# Altium project LeBot.PrjPCB
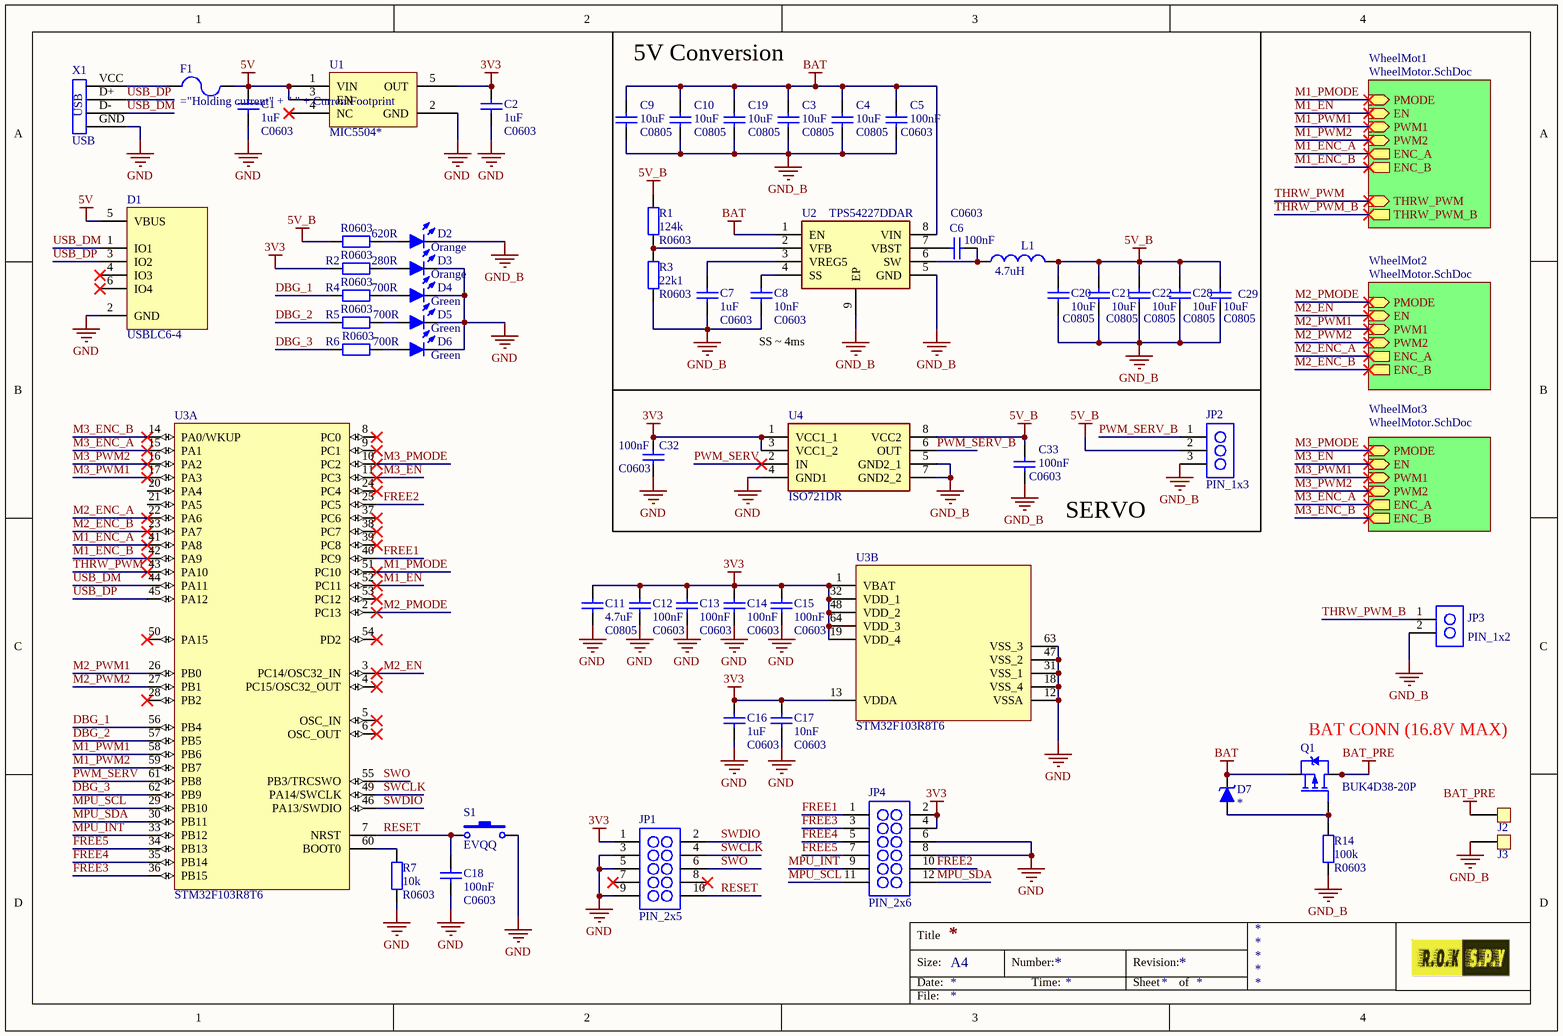
[diagram p0: LeBot.SchDoc]
2 sheets, 126 parts. Net scope: hierarchical (ports join the sheet entries above them; power ports are global).
Board file: LeBot.PcbDoc
Sheets:
  LeBot.SchDoc
    WheelMot1 = WheelMotor.SchDoc
    WheelMot2 = WheelMotor.SchDoc
    WheelMot3 = WheelMotor.SchDoc

## Sheet LeBot.SchDoc
size A4

### Parts
C1  Capacitance: 1uF  [C0603]
C2  Capacitance: 1uF  [C0603]
C3  Capacitance: 10uF  [C0805]
C4  Capacitance: 10uF  [C0805]
C5  Capacitance: 100nF  [C0603]
C6  Capacitance: 100nF  [C0603]
C7  Capacitance: 1uF  [C0603]
C8  Capacitance: 10nF  [C0603]
C9  Capacitance: 10uF  [C0805]
C10  Capacitance: 10uF  [C0805]
C11  Capacitance: 4.7uF  [C0805]
C12  Capacitance: 100nF  [C0603]
C13  Capacitance: 100nF  [C0603]
C14  Capacitance: 100nF  [C0603]
C15  Capacitance: 100nF  [C0603]
C16  Capacitance: 1uF  [C0603]
C17  Capacitance: 10nF  [C0603]
C18  Capacitance: 100nF  [C0603]
C19  Capacitance: 10uF  [C0805]
C20  Capacitance: 10uF  [C0805]
C21  Capacitance: 10uF  [C0805]
C22  Capacitance: 10uF  [C0805]
C28  Capacitance: 10uF  [C0805]
C29  Capacitance: 10uF  [C0805]
C32  Capacitance: 100nF  [C0603]
C33  Capacitance: 100nF  [C0603]
D1  USBLC6-4  [SOT-236]
D2  Colour: Orange  [LED_0805]
D3  Colour: Orange  [LED_0805]
D4  Colour: Green  [LED_0805]
D5  Colour: Green  [LED_0805]
D6  Colour: Green  [LED_0805]
D7  *  [SOT23-Zener]
F1  (no value)  [F1210]
J2  Connection_pad  [Wire_Pad]  (value not drawn)
J3  Connection_pad  [Wire_Pad]  (value not drawn)
JP1  PIN_2x5  [1.27_2X5H]
JP2  PIN_1x3  [1.27_1X3H]
JP3  PIN_1x2  [1.27_1X2H]
JP4  PIN_2x6  [1.27_2X6H]
L1  Inductance: 4.7uH  [L73]  (hidden comment: Inductor)
Q1  BUK4D38-20P  [PMPB12EPX]
R1  124k  [R0603]
R2  280R  [R0603]
R3  22k1  [R0603]
R4  700R  [R0603]
R5  700R  [R0603]
R6  700R  [R0603]
R7  10k  [R0603]
R8  620R  [R0603]
R14  100k  [R0603]
S1  EVQQ  [EVQQ]
U1  MIC5504*  [SOT-235]
U2  TPS54227DDAR  [SOIC127P600X175-8N]
U3  STM32F103R8T6  [QFP50P1200X1200X160-64N]  (parts A,B of 2)
U4  ISO721DR  [SOIC127P600X175-8N]
X1  USB  [USB MicroB Type 2.0]

### Sub-sheets
WheelMot1 = WheelMotor.SchDoc: PMODE (in), EN (in), PWM2 (in), ENC_A (out), PWM1 (in), ENC_B (out), THRW_PWM (in), THRW_PWM_B (out)
WheelMot2 = WheelMotor.SchDoc: PMODE (in), EN (in), PWM2 (in), ENC_A (out), PWM1 (in), ENC_B (out)
WheelMot3 = WheelMotor.SchDoc: PMODE (in), EN (in), PWM2 (in), ENC_A (out), PWM1 (in), ENC_B (out)

### Nets
3V3: C2.2 C11.2 C12.2 C13.2 C14.2 C15.2 C16.2 C17.2 C32.2 JP1.1 JP4.2 JP4.4 R2.2 U1.5(OUT) U3.1(VBAT) U3.13(VDDA) U3.19(VDD_4) U3.32(VDD_1) U3.48(VDD_2) U3.64(VDD_3) U4.1(VCC1_1) U4.3(VCC1_2)
5V: C1.2 D1.5(VBUS) F1.2 U1.1(VIN) U1.3(EN)
5V_B: C20.2 C21.2 C22.2 C28.2 C29.2 C33.2 JP2.2 L1.2 R1.2 R8.2 U4.8(VCC2)
BAT: C3.2 C4.2 C5.2 C9.2 C10.2 C19.2 D7.2(K) Q1.1(S) U2.1(EN) U2.8(VIN)
BAT_PRE: J2.1 Q1.3(D) Q1.D0(D) Q1.D1(D) Q1.D2(D)
GND: C1.1 C2.1 C11.1 C12.1 C13.1 C14.1 C15.1 C16.1 C17.1 C18.1 C32.1 D1.2(GND) D3.2(K) D4.2(K) D5.2(K) D6.2(K) JP1.3 JP1.5 JP1.9 JP4.6 JP4.8 R7.1 S1.2 U1.2(GND) U3.12(VSSA) U3.18(VSS_4) U3.31(VSS_1) U3.47(VSS_2) U3.63(VSS_3) U4.4(GND1) X1.GND
GND_B: C3.1 C4.1 C5.1 C7.1 C8.1 C9.1 C10.1 C19.1 C20.1 C21.1 C22.1 C28.1 C29.1 C33.1 D2.2(K) J3.1 JP2.3 JP3.2 R3.1 R14.2 U2.5(GND) U2.9(EP) U4.5(GND2_1) U4.7(GND2_2)
DBG_1: R4.2 U3.56(PB4)
DBG_2: R5.2 U3.57(PB5)
DBG_3: R6.2 U3.62(PB9)
FREE1: JP4.1 U3.40(PC9)
FREE2: JP4.10 U3.25(PC5)
FREE3: JP4.3 U3.36(PB15)
FREE4: JP4.5 U3.35(PB14)
FREE5: JP4.7 U3.34(PB13)
M1_EN: U3.52(PC11) ; sheet WheelMot1/EN
M1_ENC_A: U3.41(PA8) ; sheet WheelMot1/ENC_A
M1_ENC_B: U3.42(PA9) ; sheet WheelMot1/ENC_B
M1_PMODE: U3.51(PC10) ; sheet WheelMot1/PMODE
M1_PWM1: U3.58(PB6) ; sheet WheelMot1/PWM1
M1_PWM2: U3.59(PB7) ; sheet WheelMot1/PWM2
M2_EN: U3.3(PC14/OSC32_IN) ; sheet WheelMot2/EN
M2_ENC_A: U3.22(PA6) ; sheet WheelMot2/ENC_A
M2_ENC_B: U3.23(PA7) ; sheet WheelMot2/ENC_B
M2_PMODE: U3.2(PC13) ; sheet WheelMot2/PMODE
M2_PWM1: U3.26(PB0) ; sheet WheelMot2/PWM1
M2_PWM2: U3.27(PB1) ; sheet WheelMot2/PWM2
M3_EN: U3.11(PC3) ; sheet WheelMot3/EN
M3_ENC_A: U3.15(PA1) ; sheet WheelMot3/ENC_A
M3_ENC_B: U3.14(PA0/WKUP) ; sheet WheelMot3/ENC_B
M3_PMODE: U3.10(PC2) ; sheet WheelMot3/PMODE
M3_PWM1: U3.17(PA3) ; sheet WheelMot3/PWM1
M3_PWM2: U3.16(PA2) ; sheet WheelMot3/PWM2
MPU_INT: JP4.9 U3.33(PB12)
MPU_SCL: JP4.11 U3.29(PB10)
MPU_SDA: JP4.12 U3.30(PB11)
PWM_SERV: U3.61(PB8) U4.2(IN)
PWM_SERV_B: JP2.1 U4.6(OUT)
RESET: C18.2 JP1.10 S1.1 U3.7(NRST)
SWCLK: JP1.4 U3.49(PA14/SWCLK)
SWDIO: JP1.2 U3.46(PA13/SWDIO)
SWO: JP1.6 U3.55(PB3/TRCSWO)
THRW_PWM: U3.43(PA10) ; sheet WheelMot1/THRW_PWM
THRW_PWM_B: JP3.1 ; sheet WheelMot1/THRW_PWM_B
USB_DM: D1.1(IO1) U3.44(PA11) X1.D-
USB_DP: D1.3(IO2) U3.45(PA12) X1.D+
NetC6_1: C6.1 L1.1 U2.6(SW)
NetC6_2: C6.2 U2.7(VBST)
NetC7_2: C7.2 U2.3(VREG5)
NetC8_2: C8.2 U2.4(SS)
NetD2_1: D2.1(A) R8.1
NetD3_1: D3.1(A) R2.1
NetD4_1: D4.1(A) R4.1
NetD5_1: D5.1(A) R5.1
NetD6_1: D6.1(A) R6.1
NetD7_1: D7.1(A) Q1.2(G) R14.1
NetF1_1: F1.1 X1.VCC
NetR1_1: R1.1 R3.2 U2.2(VFB)
NetR7_2: R7.2 U3.60(BOOT0)

Not connected (* = marked no-connect by the designer): D1 4(IO3)* 6(IO4)*; JP1 7* 8*; U1 4(NC)*; U3 4(PC15/OSC32_OUT)* 5(OSC_IN)* 6(OSC_OUT)* 8(PC0)* 9(PC1)* 20(PA4) 21(PA5) 24(PC4)* 28(PB2)* 37(PC6)* 38(PC7)* 39(PC8)* 50(PA15)* 53(PC12)* 54(PD2)*

### Notes on the sheet
- 5V Conversion
- SS ~ 4ms
- SERVO
- (near Q1) BAT CONN (16.8V MAX)
- Title
- Size:
- Date:
- A4
- Number:
- Time:
- Revision:
- Sheet
- of
- File:

### Library data of the parts
C1-C22 C28 C29 C32 C33 = Capacitor: Ceramic capacitor; Type: MLCC; Voltage rating: *V; ComponentLinknDescription: Datasheet; Characteristic: *; Manufacturer: *; ComponentLinknURL: *
  C1 C2 C5-C8 C12-C18 C32 C33: Note: C0603
  C3 C4 C9-C11 C19-C22 C28 C29: Note: C0805
D1 = USBLC6-4: USB ESD Protection; Manufacturer: ST Microelectronics; ComponentLinknDescription: Datasheet; Space heritage: false; Verified: false; Part number: USBLC6-4
D2 D3 = LED: Light Emitting Diode; Part number: MC011368; ComponentLinknDescription: Datasheet; Forward Voltage: 2.1V; Space heritage: false; Forward Current: 20mA; Power dissipation: false; Farnell Order Nr: 3015159
D4-D6 = LED: Light Emitting Diode; Part number: KP-2012LSGC; ComponentLinknDescription: Datasheet; Forward Voltage: 1.9V; Space heritage: false; Forward Current: 2mA; Power dissipation: false; Farnell Order Nr: 2463991
D7 = Zener Diode: PartNumber: *; Parameter 3: *; Parameter 4: *; Farnell Order Nr: *; Zener Voltage: *; Parameter 2: *
F1 = Fuse: Operating voltage: *V; Initial resistance: *R; Carrying current: *A; ComponentLinknDescription: Datasheet; Type: *; Manufacturer: *; Tripping current: *A; Holding current: *A; ComponentLinknURL: *; Comment_1: *; Note: ="Holding current" + " " + CurrentFootprint
L1 = Inductor: Saturation current: *A; DC resistance: *R; Self resonant frequency: *Hz; ComponentLinknDescription: Datasheet; Core material: *; RMS current: *A; Construction: *; ComponentLinknURL: *; Manufacturer: *; Note: =Inductance + " " + CurrentFootprint
Q1 = P-Channel MOSFET: GS breakdown Volt: 12V/-12V; DS Breakdown Volt: -20V; Drain Current: -18A; rDSon: 30mOhm; PartNumber: BUK4D38-20P; Farnell Order Nr: 3526152; Mouser Order Nr: 771-BUK4D38-20PX; Datasheet: https://eu.mouser.com/datasheet/2/916/BUK4D38-20P-1880069.pdf; Parameter 1: *
R1-R8 R14 = Resistor: Precision: *%; Voltage rating: *V; Temp coefficient: *ppm; Power rating: *mW; ComponentLinknDescription: Datasheet; Manufacturer: *; ComponentLinknURL: *; Note: R0603
  R1: Resistance: 124k
  R2: Resistance: 280R
  R3: Resistance: 22k1
  R4-R6: Resistance: 700R
  R7: Resistance: 10k
  R8: Resistance: 620R
  R14: Resistance: 100k
S1 = EVQQ: Switch; Manufacturer: Panasonic; ComponentLinknDescription: Datasheet; Space heritage: false; Drawn by: Erik Ilbis; Verified: false; Part number: EVQQ
U1 = MIC5504: Low-dropout voltage regulator; Manufacturer: Microchip/Micrel; Space heritage: false; Current Rating: 300 mA; Input Voltage: 2V5 to 5V5; Accuracy: 2%; Part number: MIC5504; Verified: false; Drawn by: Roberts Oskars Komarovskis; ComponentLink1Description: Datasheet; ComponentLink1URL: https://www.mouser.ee/datasheet/2/268/MIC550X-1082389.pdf; Package Type: *
U2 = TPS54227DDAR: 4.5-V to 18-V Input, 2-A SynchronousStep-DownConverter; Manufacturer_Name: Texas Instruments; Datasheet Link: http://www.ti.com/lit/gpn/tps54227; Height: 1.7mm; Manufacturer_Part_Number: TPS54227DDAR; PartNumber: TPS54227DDAR; Farnell Order Nr: 3007320
U3 = STM32F103R8T6: Medium-density performance line ARM®-based 32-bit MCU with 64 or 128 KB Flash, USB, CAN, 7 timers, 2 ADCs, 9 com. interfaces; PartNumber: STM32F103R8T6; Drawn By: Roberts Oskars Komarovskis; Farnell Order Nr: 3129750; ComponentLink1Description: Datasheet; ComponentLink1URL: https://4donline.ihs.com/images/VipMasterIC/IC/SGST/SGST-S-A0001117293/SGST-S-A0001117293-1.pdf?hkey=6D3A4C79FDBF58556ACFDE234799DDF0
U4 = ISO721DR: SO72xSingleChannelHigh-SpeedDigitalIsolators; Manufacturer_Name: Texas Instruments; Datasheet Link: http://www.ti.com/lit/gpn/ISO721; Height: 1.75mm; Manufacturer_Part_Number: ISO721DR; Farnell Order Nr: 3124779; PartNumber: ISO721DR
JP1 = PIN_2x5: Manufacturer: *; Part Number: *; ComponentLinknDescription: *; ComponentLinknURL: *; Drawn By: Erik Ilbis
JP2 = PIN_1x3: Manufacturer: *; Part Number: *; ComponentLinknDescription: *; ComponentLinknURL: *; Drawn By: Erik Ilbis
JP3 = PIN_1x2: Manufacturer: *; Part Number: *; ComponentLinknURL: *; Drawn By: Erik Ilbis; ComponentLinknDescription: *
JP4 = PIN_2x6: Manufacturer: *; Part Number: *; ComponentLinknDescription: *; ComponentLinknURL: *; Drawn By: Erik Ilbis

## Sheet WheelMotor.SchDoc
size A4
Used 3 times, as channels WheelMot1, WheelMot2, WheelMot3. Parts and nets are listed once, with the designators drawn on the sheet.
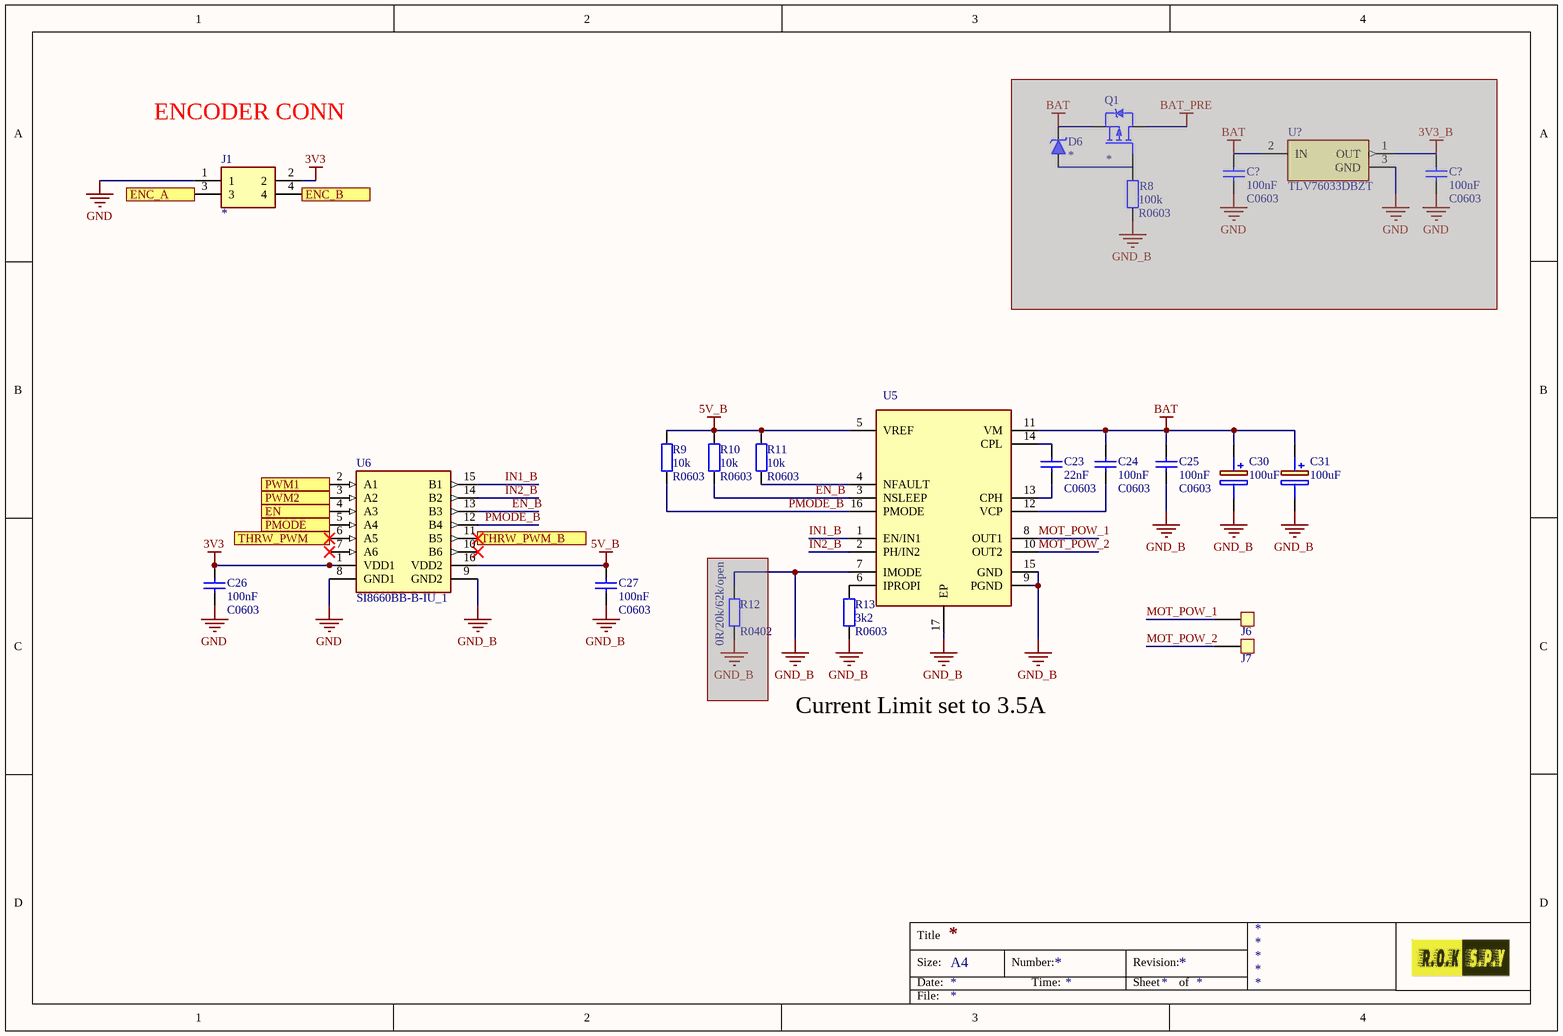
[diagram p1: WheelMotor.SchDoc]

### Parts
(Parts that share a designator on the sheet are numbered #1, #2 ... from top to bottom, then left to right.)
C23  Capacitance: 22nF  [C0603]
C24  Capacitance: 100nF  [C0603]
C25  Capacitance: 100nF  [C0603]
C26  Capacitance: 100nF  [C0603]
C27  Capacitance: 100nF  [C0603]
C30  100uF  [CAPPRD250W55D630H1220]
C31  100uF  [CAPPRD250W55D630H1220]
C?#1  Capacitance: 100nF  [C0603]  (masked out: inside a compile mask, not in the netlist)
C?#2  Capacitance: 100nF  [C0603]  (masked out: inside a compile mask, not in the netlist)
D6  *  (masked out: inside a compile mask, not in the netlist)
J1  215079-4  [TE_215079-4]  (value not drawn)
J6  Connection_pad  [Wire_Pad]  (value not drawn)
J7  Connection_pad  [Wire_Pad]  (value not drawn)
Q1  *  (masked out: inside a compile mask, not in the netlist)
R8  100k  [R0603]  (masked out: inside a compile mask, not in the netlist)
R9  10k  [R0603]
R10  10k  [R0603]
R11  10k  [R0603]
R12  0R/20k/62k/open  [R0402]  (masked out: inside a compile mask, not in the netlist)
R13  3k2  [R0603]
U5  DRV8874PWPR  [SOP65P640X120-17N]  (value not drawn)
U6  SI8660BB-B-IU_1  [SOP64P600X175-16N]
U?  TLV76033DBZT  [SOT23]  (masked out: inside a compile mask, not in the netlist)

### Ports
EN (in), ENC_A (out), ENC_B (out), PMODE (in), PWM1 (in), PWM2 (in), THRW_PWM (in), THRW_PWM_B (out)

### Nets
3V3: C26.2 J1.2 U6.1(VDD1)
5V_B: C27.2 R9.2 R10.2 R11.2 U5.5(VREF) U6.16(VDD2)
BAT: C24.2 C25.2 C30.1(+) C31.1(+) U5.11(VM)
GND: C26.1 J1.1 U6.8(GND1)
GND_B: C25.1 C27.1 C30.2(-) C31.2(-) R13.1 U5.7(IMODE) U5.9(PGND) U5.15(GND) U5.17(EP) U6.9(GND2)
EN: U6.4(A3) ; port EN
EN_B: R10.1 U5.3(NSLEEP) U6.13(B3)
ENC_A: J1.3 ; port ENC_A
ENC_B: J1.4 ; port ENC_B
IN1_B: U5.1(EN/IN1) U6.15(B1)
IN2_B: U5.2(PH/IN2) U6.14(B2)
MOT_POW_1: J6.1 U5.8(OUT1)
MOT_POW_2: J7.1 U5.10(OUT2)
PMODE: U6.5(A4) ; port PMODE
PMODE_B: R9.1 U5.16(PMODE) U6.12(B4)
PWM1: U6.2(A1) ; port PWM1
PWM2: U6.3(A2) ; port PWM2
THRW_PWM: U6.6(A5) ; port THRW_PWM
THRW_PWM_B: U6.11(B5) ; port THRW_PWM_B
NetC23_1: C23.1 U5.13(CPH)
NetC23_2: C23.2 U5.14(CPL)
NetC24_1: C24.1 U5.12(VCP)
NetR11_1: R11.1 U5.4(NFAULT)
NetR13_2: R13.2 U5.6(IPROPI)

Not connected (* = marked no-connect by the designer): U6 7(A6)* 10(B6)*

### Channels
WheelMot1: designators C23=C23_WheelMot1 C24=C24_WheelMot1 C25=C25_WheelMot1 C26=C26_WheelMot1 C27=C27_WheelMot1 C30=C30_WheelMot1 C31=C31_WheelMot1 C?=C?_WheelMot1#1 C?=C?_WheelMot1#2 D6=D6_WheelMot1 J1=J1_WheelMot1 J6=J6_WheelMot1 J7=J7_WheelMot1 Q1=Q1_WheelMot1 R8=R8_WheelMot1 R9=R9_WheelMot1 R10=R10_WheelMot1 R11=R11_WheelMot1 R12=R12_WheelMot1 R13=R13_WheelMot1 U5=U5_WheelMot1 U6=U6_WheelMot1 U?=U?_WheelMot1; ports EN=M1_EN ENC_A=M1_ENC_A ENC_B=M1_ENC_B PMODE=M1_PMODE PWM1=M1_PWM1 PWM2=M1_PWM2 THRW_PWM=THRW_PWM THRW_PWM_B=THRW_PWM_B
WheelMot2: designators C23=C23_WheelMot2 C24=C24_WheelMot2 C25=C25_WheelMot2 C26=C26_WheelMot2 C27=C27_WheelMot2 C30=C30_WheelMot2 C31=C31_WheelMot2 C?=C?_WheelMot2#1 C?=C?_WheelMot2#2 D6=D6_WheelMot2 J1=J1_WheelMot2 J6=J6_WheelMot2 J7=J7_WheelMot2 Q1=Q1_WheelMot2 R8=R8_WheelMot2 R9=R9_WheelMot2 R10=R10_WheelMot2 R11=R11_WheelMot2 R12=R12_WheelMot2 R13=R13_WheelMot2 U5=U5_WheelMot2 U6=U6_WheelMot2 U?=U?_WheelMot2; ports EN=M2_EN ENC_A=M2_ENC_A ENC_B=M2_ENC_B PMODE=M2_PMODE PWM1=M2_PWM1 PWM2=M2_PWM2 THRW_PWM=NetU6_WheelMot2_6 THRW_PWM_B=NetU6_WheelMot2_11
WheelMot3: designators C23=C23_WheelMot3 C24=C24_WheelMot3 C25=C25_WheelMot3 C26=C26_WheelMot3 C27=C27_WheelMot3 C30=C30_WheelMot3 C31=C31_WheelMot3 C?=C?_WheelMot3#1 C?=C?_WheelMot3#2 D6=D6_WheelMot3 J1=J1_WheelMot3 J6=J6_WheelMot3 J7=J7_WheelMot3 Q1=Q1_WheelMot3 R8=R8_WheelMot3 R9=R9_WheelMot3 R10=R10_WheelMot3 R11=R11_WheelMot3 R12=R12_WheelMot3 R13=R13_WheelMot3 U5=U5_WheelMot3 U6=U6_WheelMot3 U?=U?_WheelMot3; ports EN=M3_EN ENC_A=M3_ENC_A ENC_B=M3_ENC_B PMODE=M3_PMODE PWM1=M3_PWM1 PWM2=M3_PWM2 THRW_PWM=NetU6_WheelMot3_6 THRW_PWM_B=NetU6_WheelMot3_11

### Notes on the sheet
- ENCODER CONN
- Current Limit set to 3.5A
- Title
- Size:
- Date:
- A4
- Number:
- Time:
- Revision:
- Sheet
- of
- File:

### Library data of the parts
C23-C27 C?#1 C?#2 = Capacitor: as C1 on sheet LeBot; Characteristic: *; Manufacturer: *; ComponentLinknURL: *; Note: C0603
C30 C31 = EEUFC1E101S: Capacitor Polarised; Datasheet Link: *; Height: *; Manufacturer_Name: *; Manufacturer_Part_Number: *; Capacitance: 100uF; Voltage Rating: *; Farnell Order Nr: *
D6 = Zenner Diode: PartNumber: *; Parameter 2: *; Parameter 3: *; Parameter 4: *; Farnell Order Nr: *; Zenner Voltage: *
J1 = 215079-4: 4 Position Receptacle Connector Through Hole; MF: TE Connectivity; Price: None; Availability: Unavailable; SnapEDA_Link: https://www.snapeda.com/parts/215079-4/TE%20Connectivity%20AMP%20Connectors/view-part/2366486/?ref=snap; EU_RoHS_Compliance: Compliant; Value: *; MP: 215079-4; TE_purchase_URL: https://www.te.com/usa-en/product-215079-4.html?te_bu=Cor&te_type=disp&te_campaign=seda_glo_cor-seda-global-disp-prtnr-fy19-seda-model-bom-cta_sma-317_1&elqCampaignId=32493; Package: SMD-6 Omron Electronics; Comment_1: *
Q1 = P-Channel MOSFET: PartNumber: *; GS breakdown Volt: *; Farnell Order Nr: *; DS Breakdown Volt: *; Drain Current: *; rDSon: *; Parameter 2: *; Parameter 3: *; Datasheet: *
R8-R13 = Resistor: as R1 on sheet LeBot; Manufacturer: *; ComponentLinknURL: *
  R8: Resistance: 100k; Note: R0603
  R9-R11: Resistance: 10k; Note: R0603
  R12: Resistance: 0R/20k/62k/open; Note: R0402
  R13: Resistance: 3k2; Note: R0603
U5 = DRV8874PWPR: DRV8874H-BridgeMotorDriverWith IntegratedCurrentSenseand Regulation; Manufacturer_Name: Texas Instruments; Datasheet Link: https://www.ti.com/lit/gpn/DRV8874; Height: 1.2mm; Manufacturer_Part_Number: DRV8874PWPR; ComponentLink1Description: Datasheet; ComponentLink1URL: https://www.ti.com/lit/gpn/DRV8874
U6 = SI8660: Low Power Six-Channel Digital Isolator; Manufacturer_Name: Silicon Labs; Manufacturer_Part_Number: SI8661BB-B-IU; Datasheet Link: https://componentsearchengine.com//SI8661BB-B-IU.pdf; Height: 1.75mm; Mouser2 Part Number: 634-SI8661BB-B-IU; Mouser2 Price/Stock: https://www.mouser.com/Search/Refine.aspx?Keyword=634-SI8661BB-B-IU; ComponentLink1Description: Datasheet; ComponentLink1URL: https://4donline.ihs.com/images/VipMasterIC/IC/SILC/SILC-S-A0009375737/SILC-S-A0009375737-1.pdf?hkey=6D3A4C79FDBF58556ACFDE234799DDF0; Farnell Order Nr: 2423337; PartNumber: SI8660BB-B-IU_1
U? = TLV760: 100-mA,30-V, Fixed-Output,Linear-VoltageRegulator; Manufacturer_Name: Texas Instruments; Datasheet Link: http://www.ti.com/lit/ds/symlink/tlv760.pdf; Height: 0.95mm; Manufacturer_Part_Number: TLV76033DBZT; PartNumber: TLV76033DBZT; Farnell Order Nr: 3007803; ComponentLink1Description: Datasheet; ComponentLink1URL: https://www.ti.com/lit/ds/symlink/tlv760.pdf?HQS=TI-null-null-mousermode-df-pf-null-wwe&DCM=yes&ref_url=https%3A%2F%2Feu.mouser.com%2F&distId=26

## Nets that join several sheets
3V3: LeBot (22 pins), WheelMot1 (C26_WheelMot1.2 J1_WheelMot1.2 U6_WheelMot1.1), WheelMot2 (C26_WheelMot2.2 J1_WheelMot2.2 U6_WheelMot2.1), WheelMot3 (C26_WheelMot3.2 J1_WheelMot3.2 U6_WheelMot3.1)
5V_B: LeBot (11 pins), WheelMot1 (6 pins), WheelMot2 (6 pins), WheelMot3 (6 pins)
BAT: LeBot (10 pins), WheelMot1 (5 pins), WheelMot2 (5 pins), WheelMot3 (5 pins)
GND: LeBot (31 pins), WheelMot1 (C26_WheelMot1.1 J1_WheelMot1.1 U6_WheelMot1.8), WheelMot2 (C26_WheelMot2.1 J1_WheelMot2.1 U6_WheelMot2.8), WheelMot3 (C26_WheelMot3.1 J1_WheelMot3.1 U6_WheelMot3.8)
GND_B: LeBot (24 pins), WheelMot1 (10 pins), WheelMot2 (10 pins), WheelMot3 (10 pins)
M1_EN: LeBot (U3.52), WheelMot1 (U6_WheelMot1.4)
M1_ENC_A: LeBot (U3.41), WheelMot1 (J1_WheelMot1.3)
M1_ENC_B: LeBot (U3.42), WheelMot1 (J1_WheelMot1.4)
M1_PMODE: LeBot (U3.51), WheelMot1 (U6_WheelMot1.5)
M1_PWM1: LeBot (U3.58), WheelMot1 (U6_WheelMot1.2)
M1_PWM2: LeBot (U3.59), WheelMot1 (U6_WheelMot1.3)
M2_EN: LeBot (U3.3), WheelMot2 (U6_WheelMot2.4)
M2_ENC_A: LeBot (U3.22), WheelMot2 (J1_WheelMot2.3)
M2_ENC_B: LeBot (U3.23), WheelMot2 (J1_WheelMot2.4)
M2_PMODE: LeBot (U3.2), WheelMot2 (U6_WheelMot2.5)
M2_PWM1: LeBot (U3.26), WheelMot2 (U6_WheelMot2.2)
M2_PWM2: LeBot (U3.27), WheelMot2 (U6_WheelMot2.3)
M3_EN: LeBot (U3.11), WheelMot3 (U6_WheelMot3.4)
M3_ENC_A: LeBot (U3.15), WheelMot3 (J1_WheelMot3.3)
M3_ENC_B: LeBot (U3.14), WheelMot3 (J1_WheelMot3.4)
M3_PMODE: LeBot (U3.10), WheelMot3 (U6_WheelMot3.5)
M3_PWM1: LeBot (U3.17), WheelMot3 (U6_WheelMot3.2)
M3_PWM2: LeBot (U3.16), WheelMot3 (U6_WheelMot3.3)
THRW_PWM: LeBot (U3.43), WheelMot1 (U6_WheelMot1.6)
THRW_PWM_B: LeBot (JP3.1), WheelMot1 (U6_WheelMot1.11)